# Altium schematic sheet 03 - WIFI - BLE.SchDoc
size 420 x 297 mm
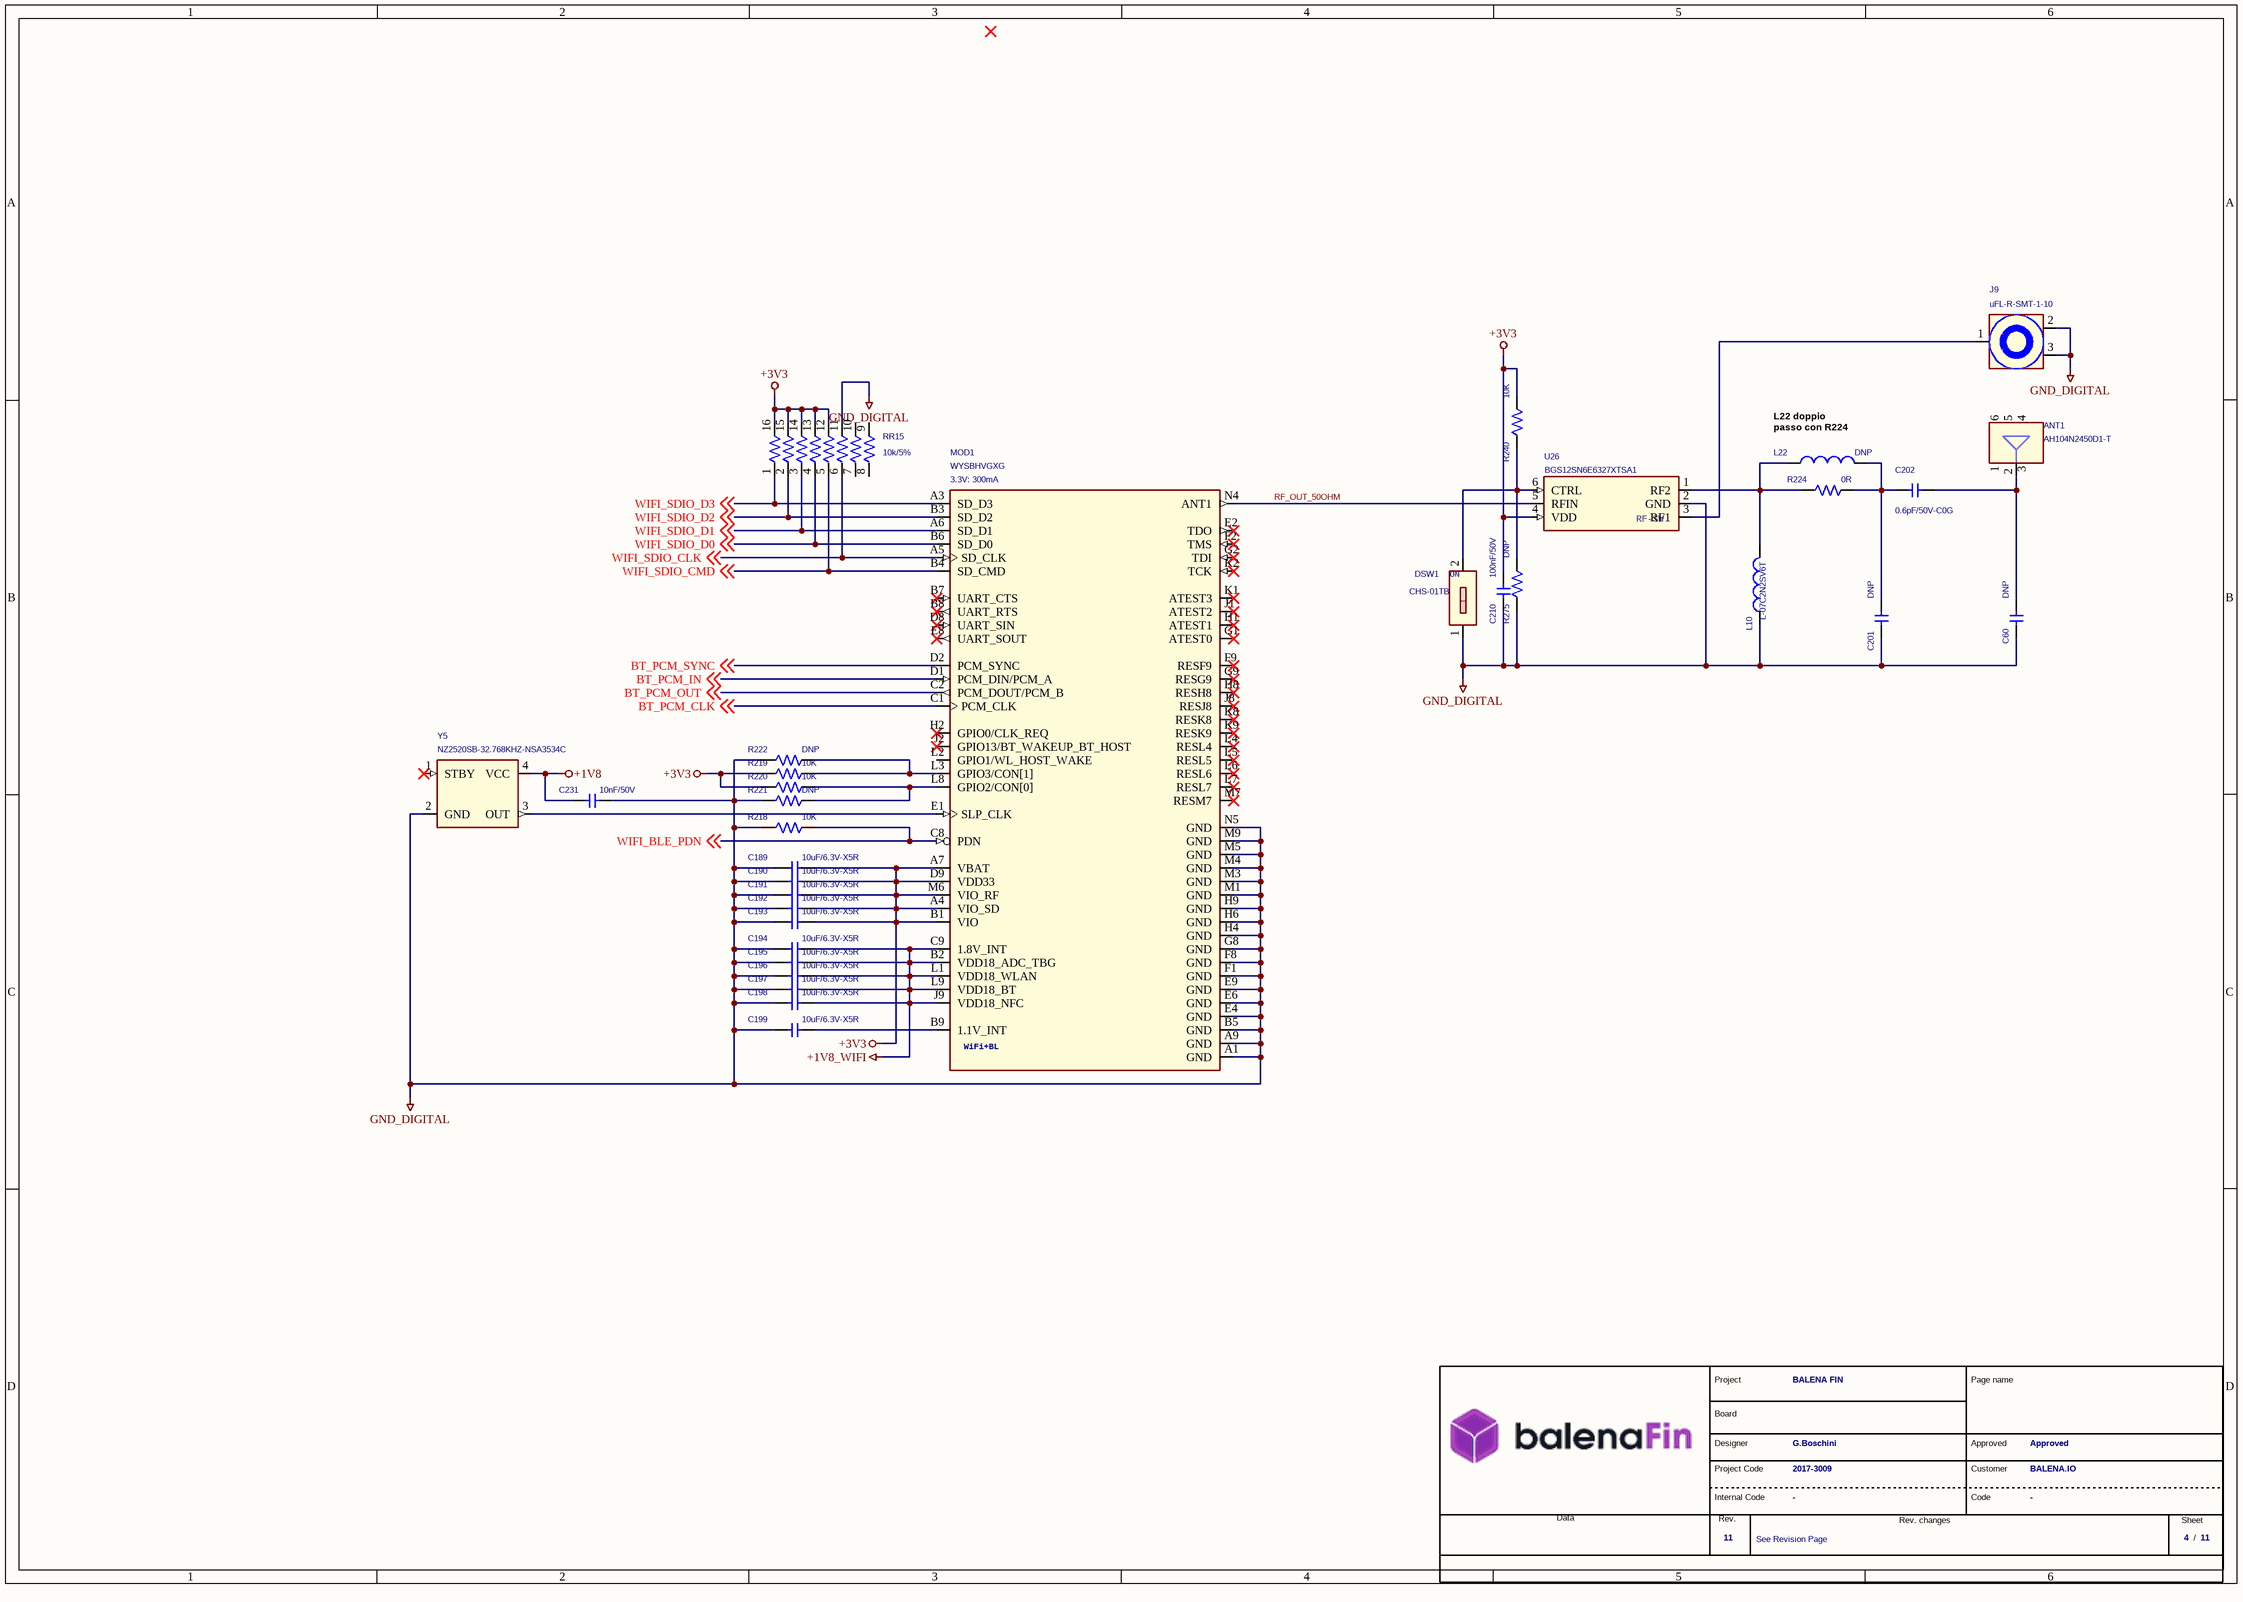
[diagram p0: 03 - WIFI - BLE.SchDoc]

## Parts
*  Revision: 11  FAE RD code: 2017-3009  DocumentoRev: See Revision Page  Page Number: 4  Nome Progetto: BALENA FIN  Customer name: BALENA.IO  Project manager: Approved  Project designer: G.Boschini  (hidden comment: MyFAEVuoto)  (graphical)
ANT1  AH104N2450D1-T  [ANT-AH104N]
C60  DNP  [CS-C-0402]
C189  10uF/6.3V-X5R  [CS-C-0402]
C190  10uF/6.3V-X5R  [CS-C-0402]
C191  10uF/6.3V-X5R  [CS-C-0402]
C192  10uF/6.3V-X5R  [CS-C-0402]
C193  10uF/6.3V-X5R  [CS-C-0402]
C194  10uF/6.3V-X5R  [CS-C-0402]
C195  10uF/6.3V-X5R  [CS-C-0402]
C196  10uF/6.3V-X5R  [CS-C-0402]
C197  10uF/6.3V-X5R  [CS-C-0402]
C198  10uF/6.3V-X5R  [CS-C-0402]
C199  10uF/6.3V-X5R  [CS-C-0402]
C201  DNP  [CS-C-0402]
C202  0.6pF/50V-C0G  [CS-C-0402]
C210  100nF/50V  [CS-C-0402]
C231  10nF/50V  [CS-C-0402]
DSW1  CHS-01TB  [DSS-CHS-01TB]
J9  uFL-R-SMT-1-10  [J-3-MDS-UFL]
L10  L-07C2N2SV6T  [LS-0402]
L22  DNP  [LS-0402]
MOD1  WYSBHVGXG  Power requirements: 3.3V: 300mA  [MOD-WYSBHVGXG]
R218  10K  [RS-0402]
R219  10K  [RS-0402]
R220  10K  [RS-0402]
R221  DNP  [RS-0402]
R222  DNP  [RS-0402]
R224  0R  [RS-0402]
R240  10K  [RS-0402]
R275  DNP  [RS-0402]
RR15  10k/5%  [RR-8X-1506]
U26  BGS12SN6E6327XTSA1  [XFDFN6]
Y5  NZ2520SB-32.768KHZ-NSA3534C  [Y-NZ2520S]

## Nets
+1V8: C231.1 Y5.4(VCC)
+1V8_WIFI: C194.2 C195.2 C196.2 C197.2 C198.2 MOD1.B2(VDD18_ADC_TBG) MOD1.C9(1.8V_INT) MOD1.J9(VDD18_NFC) MOD1.L1(VDD18_WLAN) MOD1.L9(VDD18_BT)
+3V3: C189.2 C190.2 C191.2 C192.2 C193.2 C210.2 MOD1.A4(VIO_SD) MOD1.A7(VBAT) MOD1.B1(VIO) MOD1.D9(VDD33) MOD1.M6(VIO_RF) R219.1 R220.1 R240.2 RR15.12 RR15.13 RR15.14 RR15.15 RR15.16 U26.4(VDD)
GND_DIGITAL: C60.2 C189.1 C190.1 C191.1 C192.1 C193.1 C194.1 C195.1 C196.1 C197.1 C198.1 C199.1 C201.2 C210.1 C231.2 DSW1.1 J9.2 J9.3 L10.1(C) MOD1.A1(GND) MOD1.A9(GND) MOD1.B5(GND) MOD1.E4(GND) MOD1.E6(GND) MOD1.E9(GND) MOD1.F1(GND) MOD1.F8(GND) MOD1.G8(GND) MOD1.H4(GND) MOD1.H6(GND) MOD1.H9(GND) MOD1.M1(GND) MOD1.M3(GND) MOD1.M4(GND) MOD1.M5(GND) MOD1.M9(GND) MOD1.N5(GND) R218.1 R221.1 R222.1 R275.1 RR15.11 U26.2(GND) Y5.2(GND)
BT_PCM_CLK: MOD1.C1(PCM_CLK) ; off-sheet BT_PCM_CLK
BT_PCM_IN: MOD1.D1(PCM_DIN/PCM_A) ; off-sheet BT_PCM_IN
BT_PCM_OUT: MOD1.C2(PCM_DOUT/PCM_B) ; off-sheet BT_PCM_OUT
BT_PCM_SYNC: MOD1.D2(PCM_SYNC) ; off-sheet BT_PCM_SYNC
RF_OUT_50OHM: MOD1.N4(ANT1) U26.5(RFIN)
WIFI_BLE_PDN: MOD1.C8(PDN) R218.2 ; off-sheet WIFI_BLE_PDN
WIFI_SDIO_CLK: MOD1.A5(SD_CLK) RR15.6 ; off-sheet WIFI_SDIO_CLK
WIFI_SDIO_CMD: MOD1.B4(SD_CMD) RR15.5 ; off-sheet WIFI_SDIO_CMD
WIFI_SDIO_D0: MOD1.B6(SD_D0) RR15.4 ; off-sheet WIFI_SDIO_D0
WIFI_SDIO_D1: MOD1.A6(SD_D1) RR15.3 ; off-sheet WIFI_SDIO_D1
WIFI_SDIO_D2: MOD1.B3(SD_D2) RR15.2 ; off-sheet WIFI_SDIO_D2
WIFI_SDIO_D3: MOD1.A3(SD_D3) RR15.1 ; off-sheet WIFI_SDIO_D3
NetANT1_2: ANT1.2 C60.1 C202.2
NetC199_2: C199.2 MOD1.B9(1.1V_INT)
NetC201_1: C201.1 C202.1 L22.2(A) R224.2
NetDSW1_2: DSW1.2 R240.1 R275.2 U26.6(CTRL)
NetJ9_1: J9.1 U26.3(RF1)
NetL10_2: L10.2(A) L22.1(C) R224.1 U26.1(RF2)
NetMOD1_E1: MOD1.E1(SLP_CLK) Y5.3(OUT)
NetMOD1_L3: MOD1.L3(GPIO3/CON[1]) R219.2 R222.2
NetMOD1_L8: MOD1.L8(GPIO2/CON[0]) R220.2 R221.2

Not connected (* = marked no-connect by the designer): ANT1 1 3 4 5 6; MOD1 B7(UART_CTS)* B8(UART_RTS)* D8(UART_SIN)* E2(TDO)* E8(UART_SOUT)* F2(TMS)* F9(RESF9)* G1(ATEST0)* G2(TDI)* G9(RESG9)* H1(ATEST1)* H2(GPIO0/CLK_REQ)* H8(RESH8)* J1(ATEST2)* J2(GPIO13/BT_WAKEUP_BT_HOST)* J8(RESJ8)* K1(ATEST3)* K2(TCK)* K8(RESK8)* K9(RESK9)* L2(GPIO1/WL_HOST_WAKE) L4(RESL4)* L5(RESL5)* L6(RESL6)* L7(RESL7)* M7(RESM7)*; RR15 7 8 9 10; Y5 1(STBY)*

## Notes on the sheet
- (near L22) L22 doppio
  passo con R224
- (in symbol DIP-SW-1x-CHS-01TB-SMD) ON
- (in symbol MyFAEVuoto) Project; Page name; Board; Designer; Project Code; Customer; Internal Code; Code; Data; Rev.; Rev. changes; Sheet; /
- (in symbol RF-SW - BGS12SN6E6327XTSA1) RF-SW
- (in symbol WIFI-BLE - WYSBHVGXG) WiFi+BL

## Library data of the parts
ANT1 = ANT - AH104N2450D1-T - 2.4G-5G: 2.4GHz, 5.4GHz WLAN Chip RF Antenna 2.4GHz ~ 2.5GHz, 4.9GHz ~ 5.85GHz 2.1dBi,  2.4dBi; Pkg Type: SMD; Room: WIFI-BLUETOOTH; Temperature range: -40°..+85°; MPN: AH104N2450D1-T; Mount: Yes
C60 C201 = CS-C-0402: CHIP CAP.CER. 0402; MPN: Generic; Room: WIFI-BLUETOOTH; Pkg Type: SMD; Mount: No
C189-C199 = CS-C-0402-10u/6V3-X5R: CHIP CAP.CER. 10uF 6.3V 20% X5R 0402; MPN: Generic; Alternative MPN: CC0402MRX5R5BB106; Pkg Type: SMD; Room: WIFI-BLUETOOTH; Temperature range: -55°..+85°; Mount: Yes
C202 = CS-C-0402-0.6p/50V-C0G: CHIP CAP.CER. 0.6pF 50V ±0.1pF C0G 0402; MPN: Generic; Room: WIFI-BLUETOOTH; Pkg Type: SMD; Note: RF; Temperature range: -55°..+125°; Mount: Yes
C210 = CS-C-0402-100n/16V: CHIP CAP.CER. 100nF 16V 10% X7R 0402; MPN: Generic; Alternative MPN: C0402C104K4RACTU; Room: WIFI-BLUETOOTH; Pkg Type: SMD; Mount: Yes
C231 = CS-C-0402-10n/50V: CHIP CAP.CER. 10nF 50V 10% X7R 0402; MPN: Generic; Alternative MPN: C0402C103K5RACTU; Room: WIFI-BLUETOOTH; Pkg Type: SMD; Mount: Yes
DSW1 = DIP-SW-1x-CHS-01TB-SMD: Dip Switch SPST 1 Position - Surface Mount Slide (Standard) - Actuator 100mA 6VDC; Pkg Type: SMD; Room: WIFI-BLUETOOTH; Temperature range: -40°..+85°; MPN: CHS-01TB; Mount: Yes
J9 = UFL - U-FL-R-SMT-1-10: CONN. RF M U.FL-R-SMT-1(10) HIROSE SMT; Pkg Type: SMD; Note: 50ohm; Room: WIFI-BLUETOOTH; Temperature range: -40°..+90°; MPN: uFL-R-SMT-1-10; Mount: Yes
L10 = L - L-07C2N2SV6T-2.2n/0.3A: FIXED IND 2.2NH 300MA 160MOHM SM; Pkg Type: SMD; Room: WIFI-BLUETOOTH; Temperature range: -40°..+100°; MPN: L-07C2N2SV6T; Mount: Yes
L22 = L - L-07C1N8SV6T-1.8n/0.3A: FIXED IND 1.8NH 300MA 140MOHM SM; MPN: Generic; Pkg Type: SMD; Room: WIFI-BLUETOOTH; Mount: No; Temperature range: -40°..+100°
MOD1 = WIFI-BLE - WYSBHVGXG: WiFi 802.11a/b/g/n, Bluetooth v4.2 Module 2.4GHz, 5GHz; Room: WIFI-BLUETOOTH; Pkg Type: SMD; Note: 2.4G - 5G - BLE 4.2; Temperature range: -30°..+85°; MPN: WYSBHVGXG; Mount: Yes
R218-R220 R240 = RS-0402-10k: CHIP RES. 10K 0402 1/16W 1%; MPN: Generic; Room: WIFI-BLUETOOTH; Pkg Type: SMD; Temperature range: -55°..+125°; Mount: Yes
R221 R222 R275 = RS-0402: CHIP RES. 0402; MPN: Generic; Pkg Type: SMD; Room: WIFI-BLUETOOTH; Mount: No
R224 = RS-0402-0r: CHIP RES. 0R 0402 1/16W 1%; MPN: Generic; Room: WIFI-BLUETOOTH; Pkg Type: SMD; Mount: Yes
RR15 = RR-8X-1506-10k/5%: RES ARRAY 8 RES 10K OHM 1506 5%; MPN: Generic; Alternative MPN: CAY16-103J8LF; Room: WIFI-BLUETOOTH; Note: 200ppm; Pkg Type: SMD; Temperature range: -55°..+125°; Mount: Yes
U26 = RF-SW - BGS12SN6E6327XTSA1: IC RF SWITCH SPDT 6GHZ TSNP6-2; Pkg Type: SMD; Note: 100MHz to 6GHz; Power requirements: xV: xmA; Room: WIFI-BLUETOOTH; Temperature range: -40°..+85°; MPN: BGS12SN6E6327XTSA1; Mount: Yes
Y5 = OSCILLATORE - NZ2520SB-32.768K: 32.768kHz XO (Standard) CMOS Oscillator 15pF 1.8V  30ppm 1.8V Standby (Power  Down) 4-SMD, No Lead; Pkg Type: SMD; Room: WIFI-BLUETOOTH; Temperature range: -40°..+85°; MPN: NZ2520SB-32.768KHZ-NSA3534C; Mount: Yes
* = MyFAEVuoto: Page Count: 11; Customer Code: -; Database: -